# EAGLE design BendulumClockBoard (EAGLE 6.5.0)
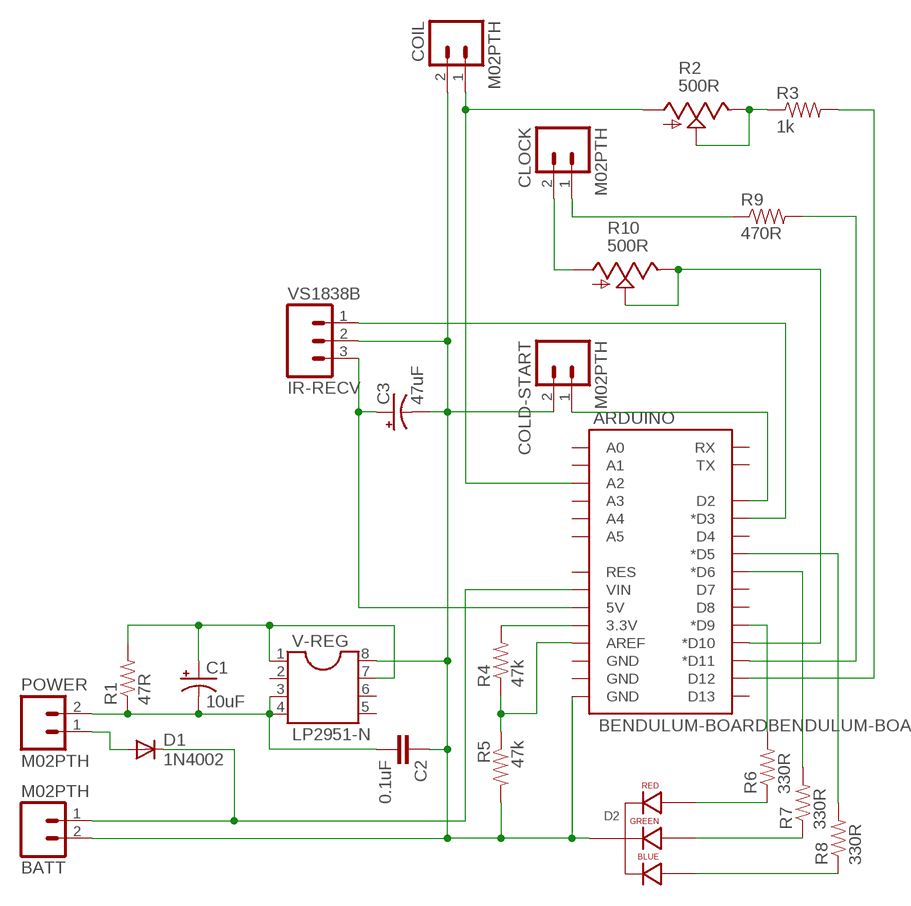
[diagram p0: schematic, sheet 1]

## Parts
ARDUINO  BENDULUM-BOARDBENDULUM-BOARD-A  [BENDULUM-BOARD]
BATT  M02PTH  [1X02]
C1  10uF  10UF-25V-20%(PTH)  [CPOL-RADIAL-10UF-25V]
C2  0.1uF  CAPPTH  [CAP-PTH-SMALL]
C3  47uF  10UF-25V-20%(PTH)  [CPOL-RADIAL-10UF-25V]
CLOCK  M02PTH  [1X02]
COIL  M02PTH  [1X02]
COLD-START  M02PTH  [1X02]
D1  1N4002  DIODE  [DIODE-1N4001-KIT]
D2  LED-RGB-CC-THRUDIFFUSE  [LED-RGB-THRU]
IR-RECV  VS1838B  M03PTH  [1X03]
POWER  M02PTH  [1X02]
R1  47R  RESISTORPTH-1/4W  [AXIAL-0.4]
R2  500R  TRIM_US-S64Y  [S64Y]
R3  1k  RESISTORPTH-1/4W  [AXIAL-0.4]
R4  47k  RESISTORPTH-1/4W  [AXIAL-0.4]
R5  47k  RESISTORPTH-1/4W  [AXIAL-0.4]
R6  330R  RESISTORPTH-1/4W  [AXIAL-0.4]
R7  330R  RESISTORPTH-1/4W  [AXIAL-0.4]
R8  330R  RESISTORPTH-1/4W  [AXIAL-0.4]
R9  470R  RESISTORPTH-1/4W  [AXIAL-0.4]
R10  500R  TRIM_US-S64Y  [S64Y]
V-REG  LP2951-N  [SOCKET-08]

## Nets
GND: ARDUINO.GND@0(GND) BATT.2 C2.1 C3.2(-) COIL.2 COLD-START.2 D2.2(CATHODE) IR-RECV.2 R5.P$2 V-REG.8(INPUT)
N$1: D1.A POWER.1
N$2: ARDUINO.VIN BATT.1 D1.C
N$3: C1.2(-) C2.2 POWER.2 R1.P$1 V-REG.3(SHUTDOWN) V-REG.4(GND)
N$4: C1.1(+) R1.P$2 V-REG.1(OUTPUT) V-REG.7(FEEDBACK)
N$5: ARDUINO.D9(*D9) R6.P$2
N$6: ARDUINO.A2 COIL.1 R2.A
N$7: ARDUINO.3.3V R4.P$2
N$8: ARDUINO.D12 R3.P$2
N$9: R2.E R2.S R3.P$1
N$10: ARDUINO.D2 COLD-START.1
N$11: ARDUINO.AREF R4.P$1 R5.P$1
N$12: ARDUINO.D6(*D6) R7.P$2
N$13: ARDUINO.D5(*D5) R8.P$2
N$14: ARDUINO.D3(*D3) IR-RECV.1
N$15: ARDUINO.5V C3.1(+) IR-RECV.3
N$17: D2.1(RED_ANODE) R6.P$1
N$18: D2.3(GREEN_ANODE) R7.P$1
N$19: D2.4(BLUE_ANODE) R8.P$1
N$20: CLOCK.2 R10.A
N$21: ARDUINO.D10(*D10) R10.E R10.S
N$22: CLOCK.1 R9.P$1
N$23: ARDUINO.D11(*D11) R9.P$2
Unconnected: ARDUINO.A0 ARDUINO.A1 ARDUINO.A3 ARDUINO.A4 ARDUINO.A5 ARDUINO.D4 ARDUINO.D7 ARDUINO.D8 ARDUINO.D13 ARDUINO.GND@1(GND) ARDUINO.GND@2(GND) ARDUINO.RES ARDUINO.RX ARDUINO.TX V-REG.2(SENSE) V-REG.5(NOT-ERROR) V-REG.6(V0-TAP)

## Library data of the parts
ARDUINO = dehne:BENDULUM-BOARD: Bendulum Clock Board Arduino shield / power for bendulum clock
BATT CLOCK COIL COLD-START POWER = SparkFun-Connectors:M02: Standard 2-pin 0.1" header. Use with - straight break away headers ( PRT-00116) - right angle break away headers (PRT-00553) - swiss pins (PRT-00743) - machine pins (PRT-00117) - female headers (PRT-00115) Molex polarized connector foot print use with: PRT-08233 with associated crimp pins and housings. 2.54_SCREWTERM for use with PRT-10571. 3.5mm Screw Terminal footprints for PRT-08084 5mm Screw Terminal footprints for use with PRT-08433
C1 C3 = SparkFun-Capacitors:10UF-25V-20%(PTH): CAP-08440; PROD_ID: CAP-08440
C2 = SparkFun-Capacitors:CAP: Capacitor Standard 0603 ceramic capacitor, and 0.1" leaded capacitor.
D1 = SparkFun-DiscreteSemi:DIODE: Diode These are standard reverse protection diodes and small signal diodes. SMA package can handle up to about 1A. SOD-323 can handle about 200mA. What the SOD-323 package when ordering, there are some mfgs out there that are 5-pin packages.
D2 = dehne:LED-RGB-CC-THRU: RGB Through-hole common cathode LED wide spacing for hand soldering; PROD_ID: DIO-09434
IR-RECV = SparkFun-Connectors:M03: Header 3 Standard 3-pin 0.1" header. Use with straight break away headers (SKU : PRT-00116), right angle break away headers (PRT-00553), swiss pins (PRT-00743), machine pins (PRT-00117), and female headers (PRT-00115). Molex polarized connector foot print use with SKU : PRT-08232 with associated crimp pins and housings.
R1 R3-R9 = SparkFun-Resistors:RESISTOR: Resistor Basic schematic elements and footprints for 0603, 1206, and PTH resistors.
R2 R10 = pot:TRIM_US-: POTENTIOMETER
V-REG = dehne:LP2951-N: LP2951-N 100 mA, Low Power Low Dropout Voltage Regulator

## Board
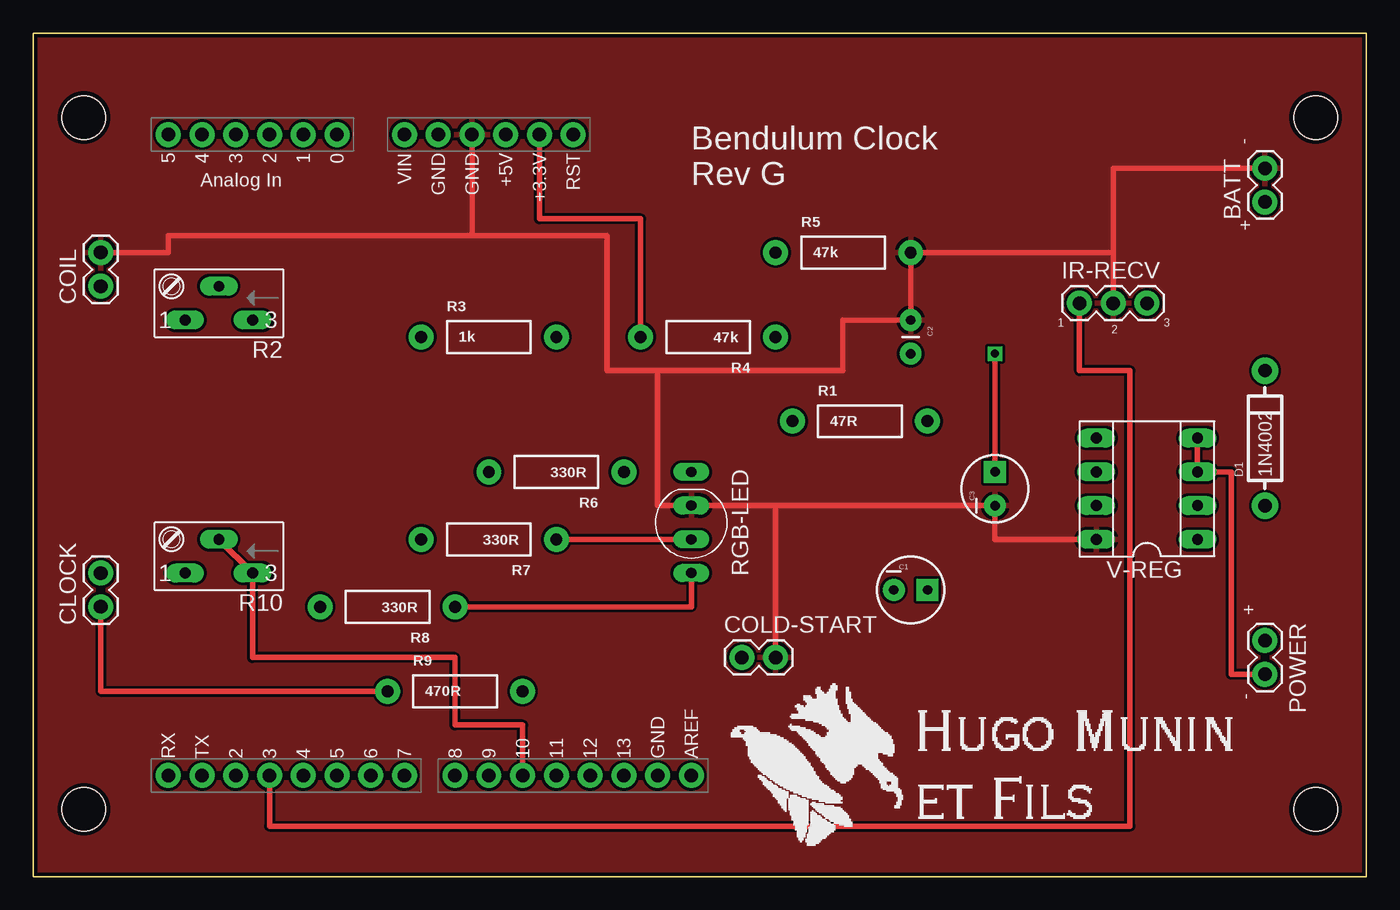
[diagram p1: board, top side]
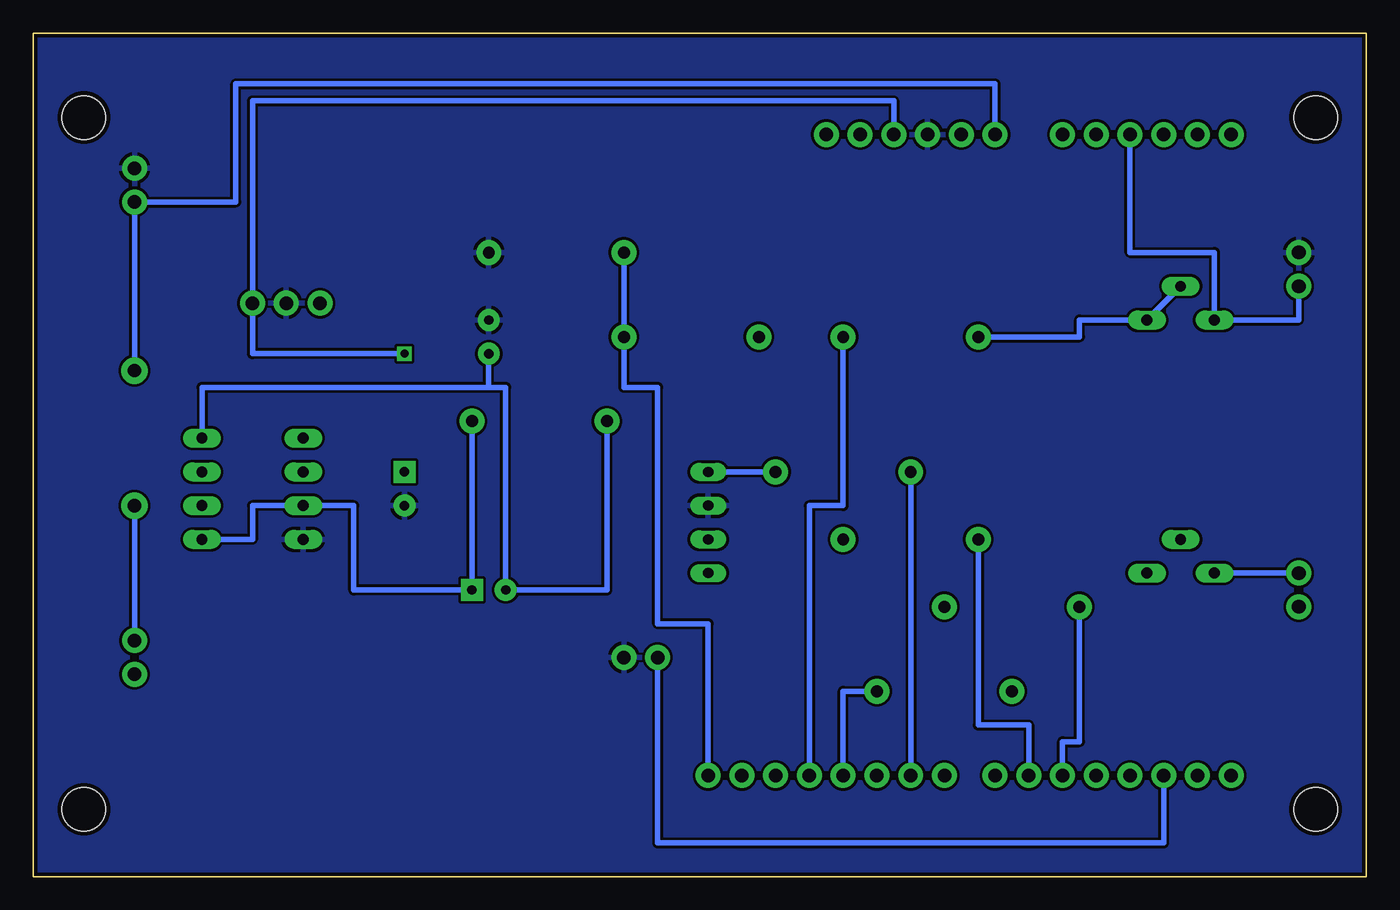
[diagram p2: board, bottom side, seen from below]

Size 100.33 x 63.5 mm. Coordinates in mm from the lower left corner, seen from the top.
Copper layers (1*16): Top 0.035mm / dielectric 1.5mm / Bottom 0.035mm
Design rules "SparkFun": minimum track width 8mil, minimum drill 20mil, track to track 8mil, track to pad 8mil, pad to pad 8mil, via to via 8mil, smd to smd 8mil, copper to edge 10mil, drill to drill 8mil, minimum pad ring 12mil, minimum via ring 10mil, stop-mask expansion 4mil, vias tented up to drill 25mil, thermal gap 10mil

### Footprints (pad centres in the part's own frame; a part is rotated, then mirrored left to right if it is on the bottom)
BENDULUM-BOARD = drill 1.016 pad 1.88: 3.3V 38.1,55.88; 5V 35.56,55.88; A0 22.86,55.88; A1 20.32,55.88; A2 17.78,55.88; A3 15.24,55.88; A4 12.7,55.88; A5 10.16,55.88; AREF 49.53,7.62; D2 15.24,7.62; D3 17.78,7.62; D4 20.32,7.62; D5 22.86,7.62; D6 25.4,7.62; D7 27.94,7.62; D8 31.75,7.62; D9 34.29,7.62; D10 36.83,7.62; D11 39.37,7.62; D12 41.91,7.62; D13 44.45,7.62; GND@0 33.02,55.88; GND@1 30.48,55.88; GND@2 46.99,7.62; RES 40.64,55.88; RX 10.16,7.62; TX 12.7,7.62; VIN 27.94,55.88 | hole 3.302: 3.81,57.15; 3.81,5.08; 96.52,5.08; 96.52,57.15
1X02 = drill 1.016 pad 1.88: 1 0,0; 2 2.54,0
CPOL-RADIAL-10UF-25V = drill 0.7 pad 1.651 square: 1 1.27,0 | drill 0.7 pad 1.651: 2 -1.27,0
CAP-PTH-SMALL = drill 0.7 pad 1.651: 1 0,0; 2 2.54,0
DIODE-1N4001-KIT = drill 1 pad 1.981: A -5.08,0; C 5.08,0
LED-RGB-THRU = drill 0.762 pad 0.889 long: 1 3.81,0; 2 1.27,0; 3 -1.27,0; 4 -3.81,0
1X03 = drill 1.016 pad 1.88: 1 0,0; 2 2.54,0; 3 5.08,0
AXIAL-0.4 = drill 0.9 pad 1.88: P$1 -5.08,0; P$2 5.08,0
S64Y = drill 0.813 long: A 2.54,1.27; E -2.54,1.27; S 0,-1.27
SOCKET-08 = drill 0.813 long: 1 -3.81,-3.81; 2 -1.27,-3.81; 3 1.27,-3.81; 4 3.81,-3.81; 5 3.81,3.81; 6 1.27,3.81; 7 -1.27,3.81; 8 -3.81,3.81

### Placement (x,y rotation side)
ARDUINO  0,0 0 top
BATT  92.71,50.8 90 top
C1  66.04,21.59 0 top
C2  66.04,41.91 270 top
C3  72.39,29.21 90 top
CLOCK  5.08,20.32 90 top
COIL  5.08,44.45 90 top
COLD-START  53.34,16.51 0 top
D1  92.71,33.02 90 top
D2  49.53,26.67 90 top
IR-RECV  78.74,43.18 0 top
POWER  92.71,17.78 270 top
R1  62.23,34.29 0 top
R2  13.97,43.18 180 top
R3  34.29,40.64 0 top
R4  50.8,40.64 180 top
R5  60.96,46.99 0 top
R6  39.37,30.48 180 top
R7  34.29,25.4 180 top
R8  26.67,20.32 180 top
R9  31.75,13.97 0 top
R10  13.97,24.13 180 top
V-REG  83.82,29.21 90 top

### Tracks (layer width: path | path; a pad name or v marks a point on that pad's centre or on a via)
GND
  Top 0.406: 55.88,27.94 D2.2 46.99,27.94 46.99,38.1 | 55.88,27.94 COLD-START.2 | 55.88,27.94 C3.2 72.39,25.4 V-REG.8 | 46.99,38.1 60.96,38.1 60.96,41.91 C2.1 R5.P$2 81.28,46.99 | 46.99,38.1 43.18,38.1 43.18,48.26 33.02,48.26 | 33.02,48.26 ARDUINO.GND@0 | COIL.2 10.16,46.99 10.16,48.26 33.02,48.26 | BATT.2 81.28,53.34 81.28,46.99 | 81.28,46.99 IR-RECV.2
  pour Bottom: 0,63.5 0,0 100.33,0 100.33,63.5
  pour Top: 0,63.5 0,0 100.33,0 100.33,63.5
N$1
  Bottom 0.406: POWER.1 D1.A
N$2
  Bottom 0.406: D1.C BATT.1 85.09,50.8 85.09,59.69 27.94,59.69 ARDUINO.VIN
N$3
  Top 0.406: POWER.2 90.17,15.24 90.17,30.48 V-REG.3 V-REG.4
  Bottom 0.406: R1.P$1 57.15,21.59 C1.2 64.77,36.83 66.04,36.83 | 66.04,36.83 C2.2 | 66.04,36.83 87.63,36.83 V-REG.4
N$4
  Bottom 0.406: R1.P$2 C1.1 76.2,21.59 76.2,27.94 V-REG.7 83.82,27.94 83.82,25.4 V-REG.1
N$5
  Bottom 0.406: R6.P$2 ARDUINO.D9
N$6
  Bottom 0.406: COIL.1 5.08,41.91 R2.A 11.43,46.99 17.78,46.99 ARDUINO.A2
N$7
  Top 0.406: R4.P$2 45.72,49.53 38.1,49.53 ARDUINO.3.3V
N$8
  Bottom 0.406: R3.P$2 39.37,27.94 41.91,27.94 ARDUINO.D12
N$9
  Bottom 0.406: R3.P$1 21.59,40.64 21.59,41.91 R2.E R2.S
N$10
  Bottom 0.406: COLD-START.1 53.34,2.54 15.24,2.54 ARDUINO.D2
N$11
  Bottom 0.406: ARDUINO.AREF 49.53,19.05 53.34,19.05 53.34,36.83 55.88,36.83 R4.P$1 R5.P$1
N$12
  Bottom 0.406: R7.P$2 29.21,11.43 25.4,11.43 ARDUINO.D6
N$13
  Bottom 0.406: ARDUINO.D5 22.86,10.16 21.59,10.16 R8.P$2
N$14
  Top 0.406: ARDUINO.D3 17.78,3.81 82.55,3.81 82.55,38.1 78.74,38.1 IR-RECV.1
N$15  (via drill 0.6)
  Top 0.406: C3.1 v72.39,39.37
  Bottom 0.406: ARDUINO.5V 35.56,58.42 83.82,58.42 IR-RECV.3 83.82,39.37 v72.39,39.37
N$17
  Bottom 0.406: R6.P$1 D2.1
N$18
  Top 0.406: D2.3 R7.P$1
N$19
  Top 0.406: D2.4 49.53,20.32 R8.P$1
N$20
  Bottom 0.406: CLOCK.2 R10.A
N$21
  Top 0.406: R10.S R10.E 16.51,16.51 31.75,16.51 31.75,11.43 36.83,11.43 ARDUINO.D10
N$22
  Top 0.406: CLOCK.1 5.08,13.97 R9.P$1
N$23
  Bottom 0.406: ARDUINO.D11 39.37,13.97 R9.P$2

### Text on the board
_tsilk: - | Bendulum Clock / Rev G | + | 1 | 2 | 3 | RGB-LED | + | -